# EAGLE schematic MbrdA_rev2.180 (EAGLE 7.2.0)
ENG_NAME: Sylwester Hyzynski

## Sheet 1 of 7
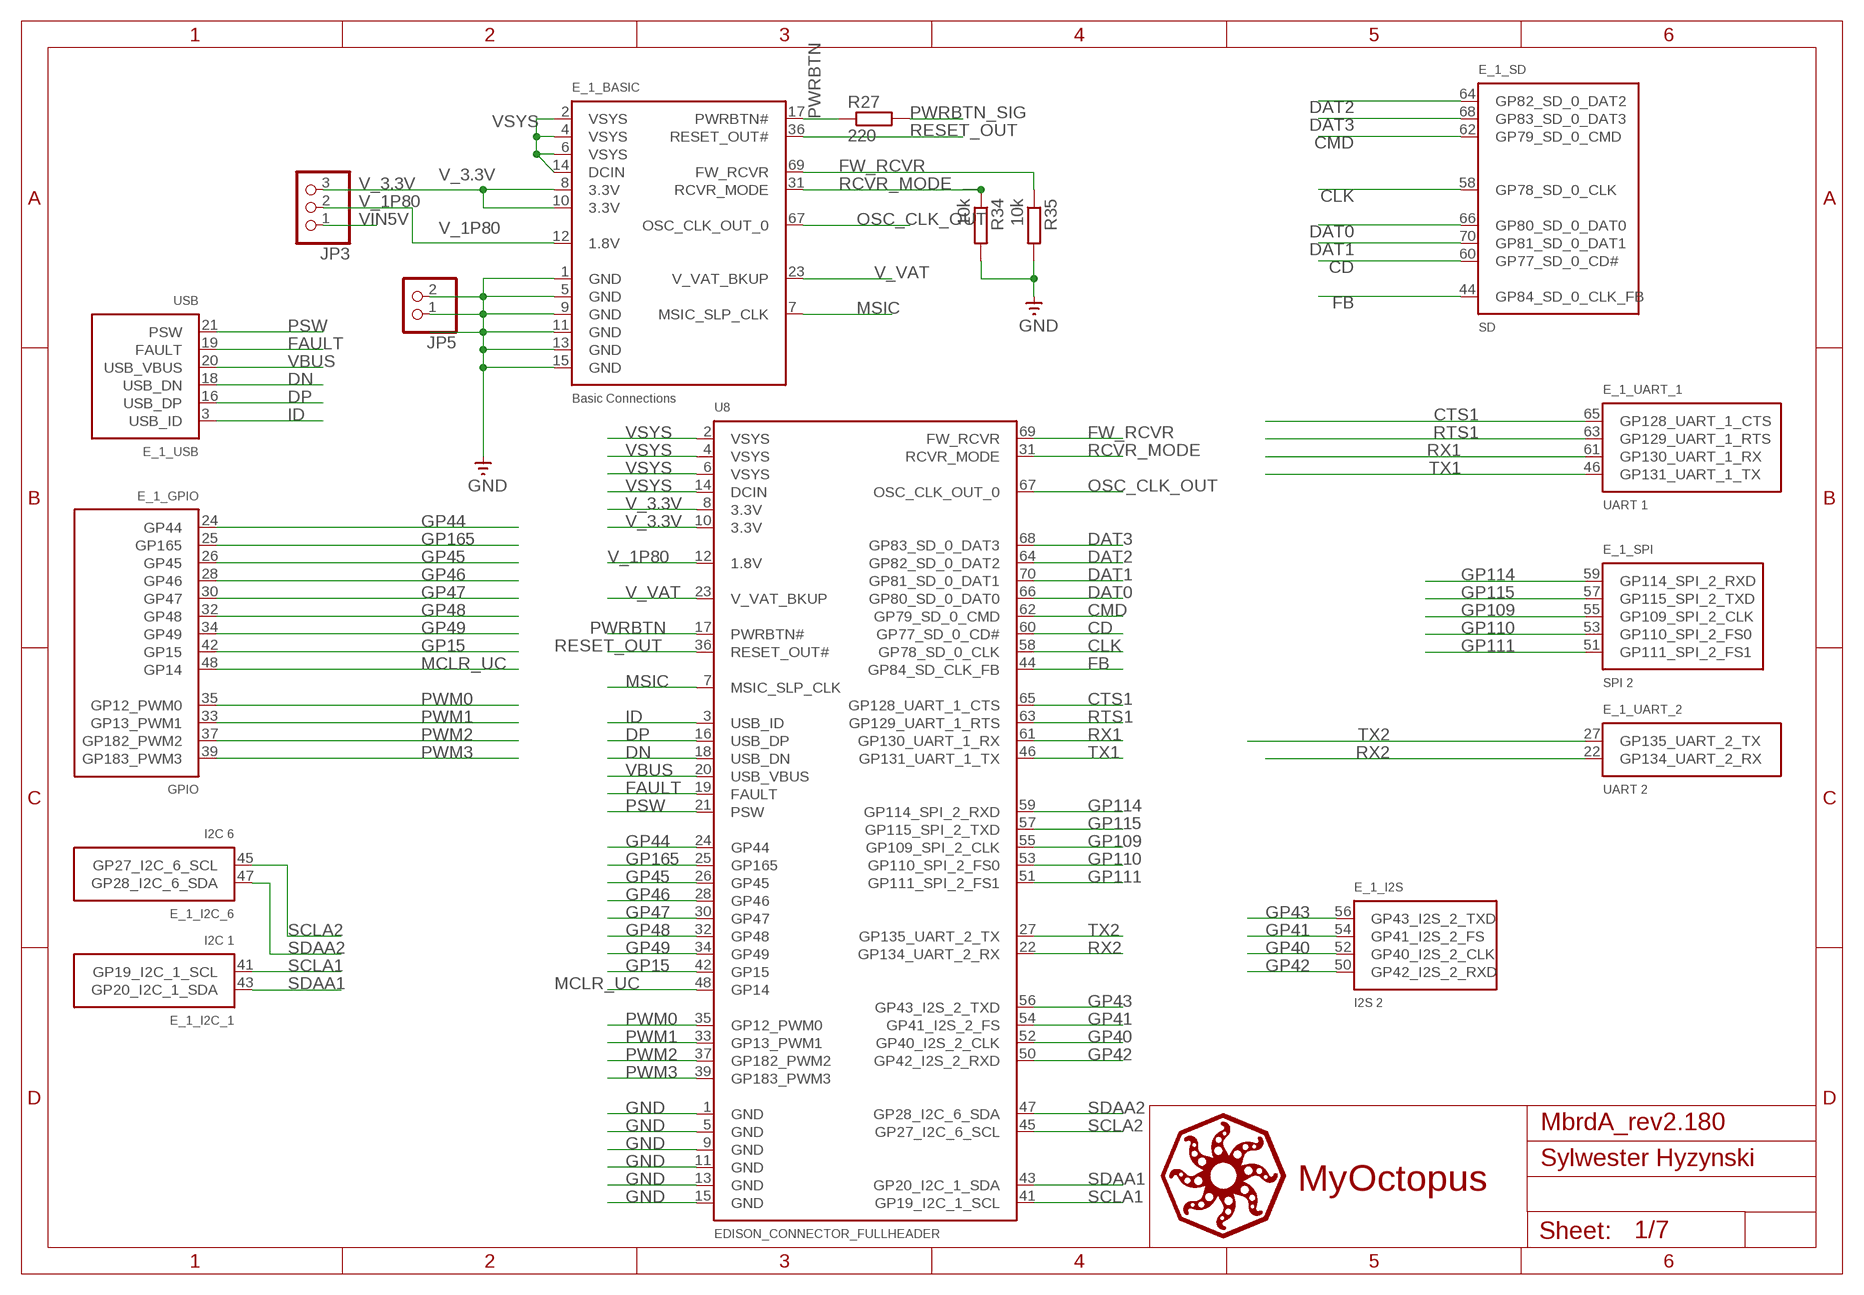
[diagram p0: schematic, sheet 1]

### Parts
E_1  EDISON_CONNECTOR_SEGMENTED  [EDISON_DAUGHTER]
JP3  PINHD-1X3  [1X03]
JP5  PINHD-1X2  [1X02]
R27  220  R-EU_R0201  [R0201]
R34  10k  R-EU_R0201  [R0201]
R35  10k  R-EU_R0201  [R0201]
U8  EDISON_CONNECTOR_FULLHEADER  [DF40C-70DP-0.4(51)]

### Nets
CD: E_1.60(_SD:GP77_SD_0_CD#) U8.60(GP77_SD_0_CD#) ; also sheet 6
CLK: E_1.58(_SD:GP78_SD_0_CLK) U8.58(GP78_SD_0_CLK) ; also sheet 6
CMD: E_1.62(_SD:GP79_SD_0_CMD) U8.62(GP79_SD_0_CMD) ; also sheet 6
CTS1: E_1.65(_UART_1:GP128_UART_1_CTS) U8.65(GP128_UART_1_CTS) ; also sheet 6
DAT0: E_1.66(_SD:GP80_SD_0_DAT0) U8.66(GP80_SD_0_DAT0) ; also sheet 6
DAT1: E_1.70(_SD:GP81_SD_0_DAT1) U8.70(GP81_SD_0_DAT1) ; also sheet 6
DAT2: E_1.64(_SD:GP82_SD_0_DAT2) U8.64(GP82_SD_0_DAT2) ; also sheet 6
DAT3: E_1.68(_SD:GP83_SD_0_DAT3) U8.68(GP83_SD_0_DAT3) ; also sheet 6
DN: E_1.18(_USB:USB_DN) U8.18(USB_DN) ; also sheet 5
DP: E_1.16(_USB:USB_DP) U8.16(USB_DP) ; also sheet 5
FAULT: E_1.19(_USB:FAULT) U8.19(FAULT) ; also sheet 5
FB: E_1.44(_SD:GP84_SD_0_CLK_FB) U8.44(GP84_SD_CLK_FB) ; also sheet 6
FW_RCVR: E_1.69(_BASIC:FW_RCVR) R35.1 U8.69(FW_RCVR) ; also sheet 6
GND: E_1.1(_BASIC:GND) E_1.5(_BASIC:GND) E_1.9(_BASIC:GND) E_1.11(_BASIC:GND) E_1.13(_BASIC:GND) E_1.15(_BASIC:GND) JP5.1 JP5.2 R34.2 R35.2 U8.1(GND) U8.5(GND) U8.9(GND) U8.11(GND) U8.13(GND) U8.15(GND) ; also sheet 2,3,4,5,6,7
GP15: E_1.42(_GPIO:GP15) U8.42(GP15)
GP40: E_1.52(_I2S:GP40_I2S_2_CLK) U8.52(GP40_I2S_2_CLK)
GP41: E_1.54(_I2S:GP41_I2S_2_FS) U8.54(GP41_I2S_2_FS)
GP42: E_1.50(_I2S:GP42_I2S_2_RXD) U8.50(GP42_I2S_2_RXD)
GP43: E_1.56(_I2S:GP43_I2S_2_TXD) U8.56(GP43_I2S_2_TXD)
GP44: E_1.24(_GPIO:GP44) U8.24(GP44) ; also sheet 6
GP45: E_1.26(_GPIO:GP45) U8.26(GP45) ; also sheet 6
GP46: E_1.28(_GPIO:GP46) U8.28(GP46) ; also sheet 6
GP47: E_1.30(_GPIO:GP47) U8.30(GP47)
GP48: E_1.32(_GPIO:GP48) U8.32(GP48) ; also sheet 6
GP49: E_1.34(_GPIO:GP49) U8.34(GP49) ; also sheet 6
GP109: E_1.55(_SPI:GP109_SPI_2_CLK) U8.55(GP109_SPI_2_CLK)
GP110: E_1.53(_SPI:GP110_SPI_2_FS0) U8.53(GP110_SPI_2_FS0)
GP111: E_1.51(_SPI:GP111_SPI_2_FS1) U8.51(GP111_SPI_2_FS1)
GP114: E_1.59(_SPI:GP114_SPI_2_RXD) U8.59(GP114_SPI_2_RXD)
GP115: E_1.57(_SPI:GP115_SPI_2_TXD) U8.57(GP115_SPI_2_TXD)
GP165: E_1.25(_GPIO:GP165) U8.25(GP165) ; also sheet 6
ID: E_1.3(_USB:USB_ID) U8.3(USB_ID) ; also sheet 5
MCLR_UC: E_1.48(_GPIO:GP14) U8.48(GP14) ; also sheet 4
MSIC: E_1.7(_BASIC:MSIC_SLP_CLK) U8.7(MSIC_SLP_CLK)
OSC_CLK_OUT: E_1.67(_BASIC:OSC_CLK_OUT_0) U8.67(OSC_CLK_OUT_0)
PSW: E_1.21(_USB:PSW) U8.21(PSW) ; also sheet 5
PWM0: E_1.35(_GPIO:GP12_PWM0) U8.35(GP12_PWM0) ; also sheet 6
PWM1: E_1.33(_GPIO:GP13_PWM1) U8.33(GP13_PWM1) ; also sheet 6
PWM2: E_1.37(_GPIO:GP182_PWM2) U8.37(GP182_PWM2)
PWM3: E_1.39(_GPIO:GP183_PWM3) U8.39(GP183_PWM3)
PWRBTN: E_1.17(_BASIC:PWRBTN#) R27.1 U8.17(PWRBTN#)
PWRBTN_SIG: R27.2 ; also sheet 4
RCVR_MODE: E_1.31(_BASIC:RCVR_MODE) R34.1 U8.31(RCVR_MODE) ; also sheet 6
RESET_OUT: E_1.36(_BASIC:RESET_OUT#) U8.36(RESET_OUT#) ; also sheet 4
RTS1: E_1.63(_UART_1:GP129_UART_1_RTS) U8.63(GP129_UART_1_RTS) ; also sheet 6
RX1: E_1.61(_UART_1:GP130_UART_1_RX) U8.61(GP130_UART_1_RX) ; also sheet 6
RX2: E_1.22(_UART_2:GP134_UART_2_RX) U8.22(GP134_UART_2_RX) ; also sheet 6
SCLA1: E_1.41(_I2C_1:GP19_I2C_1_SCL) U8.41(GP19_I2C_1_SCL) ; also sheet 2
SCLA2: E_1.45(_I2C_6:GP27_I2C_6_SCL) U8.45(GP27_I2C_6_SCL) ; also sheet 2
SDAA1: E_1.43(_I2C_1:GP20_I2C_1_SDA) U8.43(GP20_I2C_1_SDA) ; also sheet 2
SDAA2: E_1.47(_I2C_6:GP28_I2C_6_SDA) U8.47(GP28_I2C_6_SDA) ; also sheet 2
TX1: E_1.46(_UART_1:GP131_UART_1_TX) U8.46(GP131_UART_1_TX) ; also sheet 6
TX2: E_1.27(_UART_2:GP135_UART_2_TX) U8.27(GP135_UART_2_TX) ; also sheet 6
V_1P80 [v_1P80]: E_1.12(_BASIC:1.8V) JP3.2 U8.12(1.8V) ; also sheet 2,4,5,6
V_3.3V [v_3.3V]: E_1.8(_BASIC:3.3V) E_1.10(_BASIC:3.3V) JP3.3 U8.8(3.3V) U8.10(3.3V) ; also sheet 2,6,7
V_VAT: E_1.23(_BASIC:V_VAT_BKUP) U8.23(V_VAT_BKUP)
VBUS: E_1.20(_USB:USB_VBUS) U8.20(USB_VBUS) ; also sheet 5
VIN5V [Vin5v]: JP3.1 ; also sheet 2,3,4,5,6,7
VSYS: E_1.2(_BASIC:VSYS) E_1.4(_BASIC:VSYS) E_1.6(_BASIC:VSYS) E_1.14(_BASIC:DCIN) U8.2(VSYS) U8.4(VSYS) U8.6(VSYS) U8.14(DCIN) ; also sheet 4,5

## Sheet 2 of 7
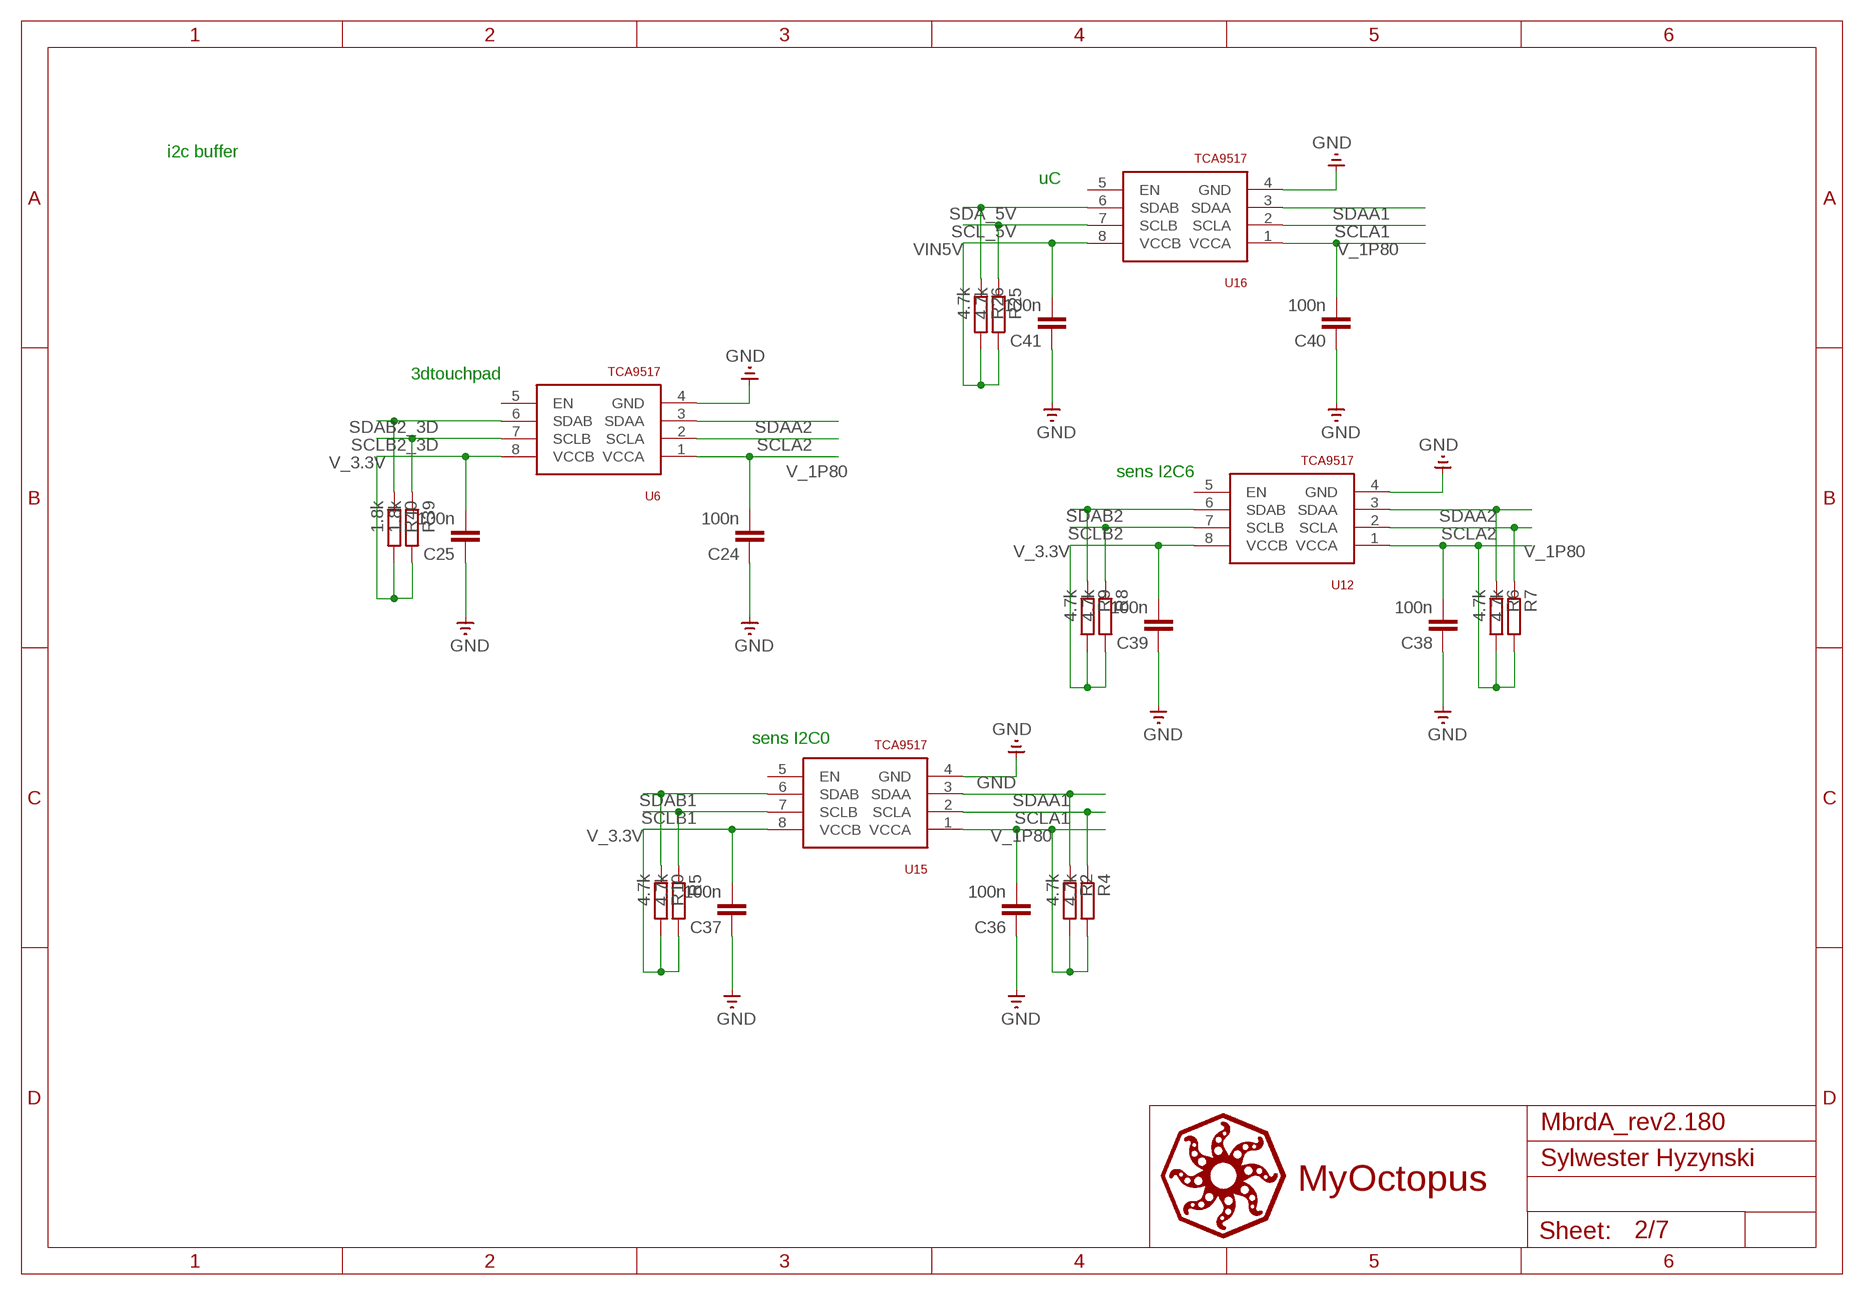
[diagram p1: schematic, sheet 2]

### Parts
C24  100n  C-EUC0201  [C0201]
C25  100n  C-EUC0201  [C0201]
C36  100n  C-EUC0201  [C0201]
C37  100n  C-EUC0201  [C0201]
C38  100n  C-EUC0201  [C0201]
C39  100n  C-EUC0201  [C0201]
C40  100n  C-EUC0201  [C0201]
C41  100n  C-EUC0201  [C0201]
R2  4.7k  R-EU_R0201  [R0201]
R4  4.7k  R-EU_R0201  [R0201]
R5  4.7k  R-EU_R0201  [R0201]
R6  4.7k  R-EU_R0201  [R0201]
R7  4.7k  R-EU_R0201  [R0201]
R8  4.7k  R-EU_R0201  [R0201]
R9  4.7k  R-EU_R0201  [R0201]
R10  4.7k  R-EU_R0201  [R0201]
R25  4.7k  R-EU_R0201  [R0201]
R26  4.7k  R-EU_R0201  [R0201]
R39  1.8k  R-EU_R0201  [R0201]
R40  1.8k  R-EU_R0201  [R0201]
U6  TCA9517  [SO-08]
U12  TCA9517  [SO-08]
U15  TCA9517  [SO-08]
U16  TCA9517  [SO-08]

### Nets
GND: C24.1 C25.1 C36.1 C37.1 C38.1 C39.1 C40.1 C41.1 U6.4(GND) U12.4(GND) U15.4(GND) U16.4(GND) ; also sheet 1,3,4,5,6,7
SCL_5V: R25.1 U16.7(SCLB) ; also sheet 3
SCLA1: R4.1 U15.2(SCLA) U16.2(SCLA) ; also sheet 1
SCLA2: R7.1 U6.2(SCLA) U12.2(SCLA) ; also sheet 1
SCLB1: R5.1 U15.7(SCLB) ; also sheet 7
SCLB2: R8.1 U12.7(SCLB) ; also sheet 7
SCLB2_3D: R39.1 U6.7(SCLB) ; also sheet 7
SDA_5V: R26.1 U16.6(SDAB) ; also sheet 3
SDAA1: R2.1 U15.3(SDAA) U16.3(SDAA) ; also sheet 1
SDAA2: R6.1 U6.3(SDAA) U12.3(SDAA) ; also sheet 1
SDAB1: R10.1 U15.6(SDAB) ; also sheet 7
SDAB2: R9.1 U12.6(SDAB) ; also sheet 7
SDAB2_3D: R40.1 U6.6(SDAB) ; also sheet 7
V_1P80 [v_1P80]: C24.2 C36.2 C38.2 C40.2 R2.2 R4.2 R6.2 R7.2 U6.1(VCCA) U12.1(VCCA) U15.1(VCCA) U16.1(VCCA) ; also sheet 1,4,5,6
V_3.3V [v_3.3V]: C25.2 C37.2 C39.2 R5.2 R8.2 R9.2 R10.2 R39.2 R40.2 U6.8(VCCB) U12.8(VCCB) U15.8(VCCB) ; also sheet 1,6,7
VIN5V [Vin5v]: C41.2 R25.2 R26.2 U16.8(VCCB) ; also sheet 1,3,4,5,6,7
Unconnected: U6.5(EN) U12.5(EN) U15.5(EN) U16.5(EN)

### Notes on the sheet
- i2c buffer
- uC
- 3dtouchpad
- sens I2C6
- sens I2C0

## Sheet 3 of 7
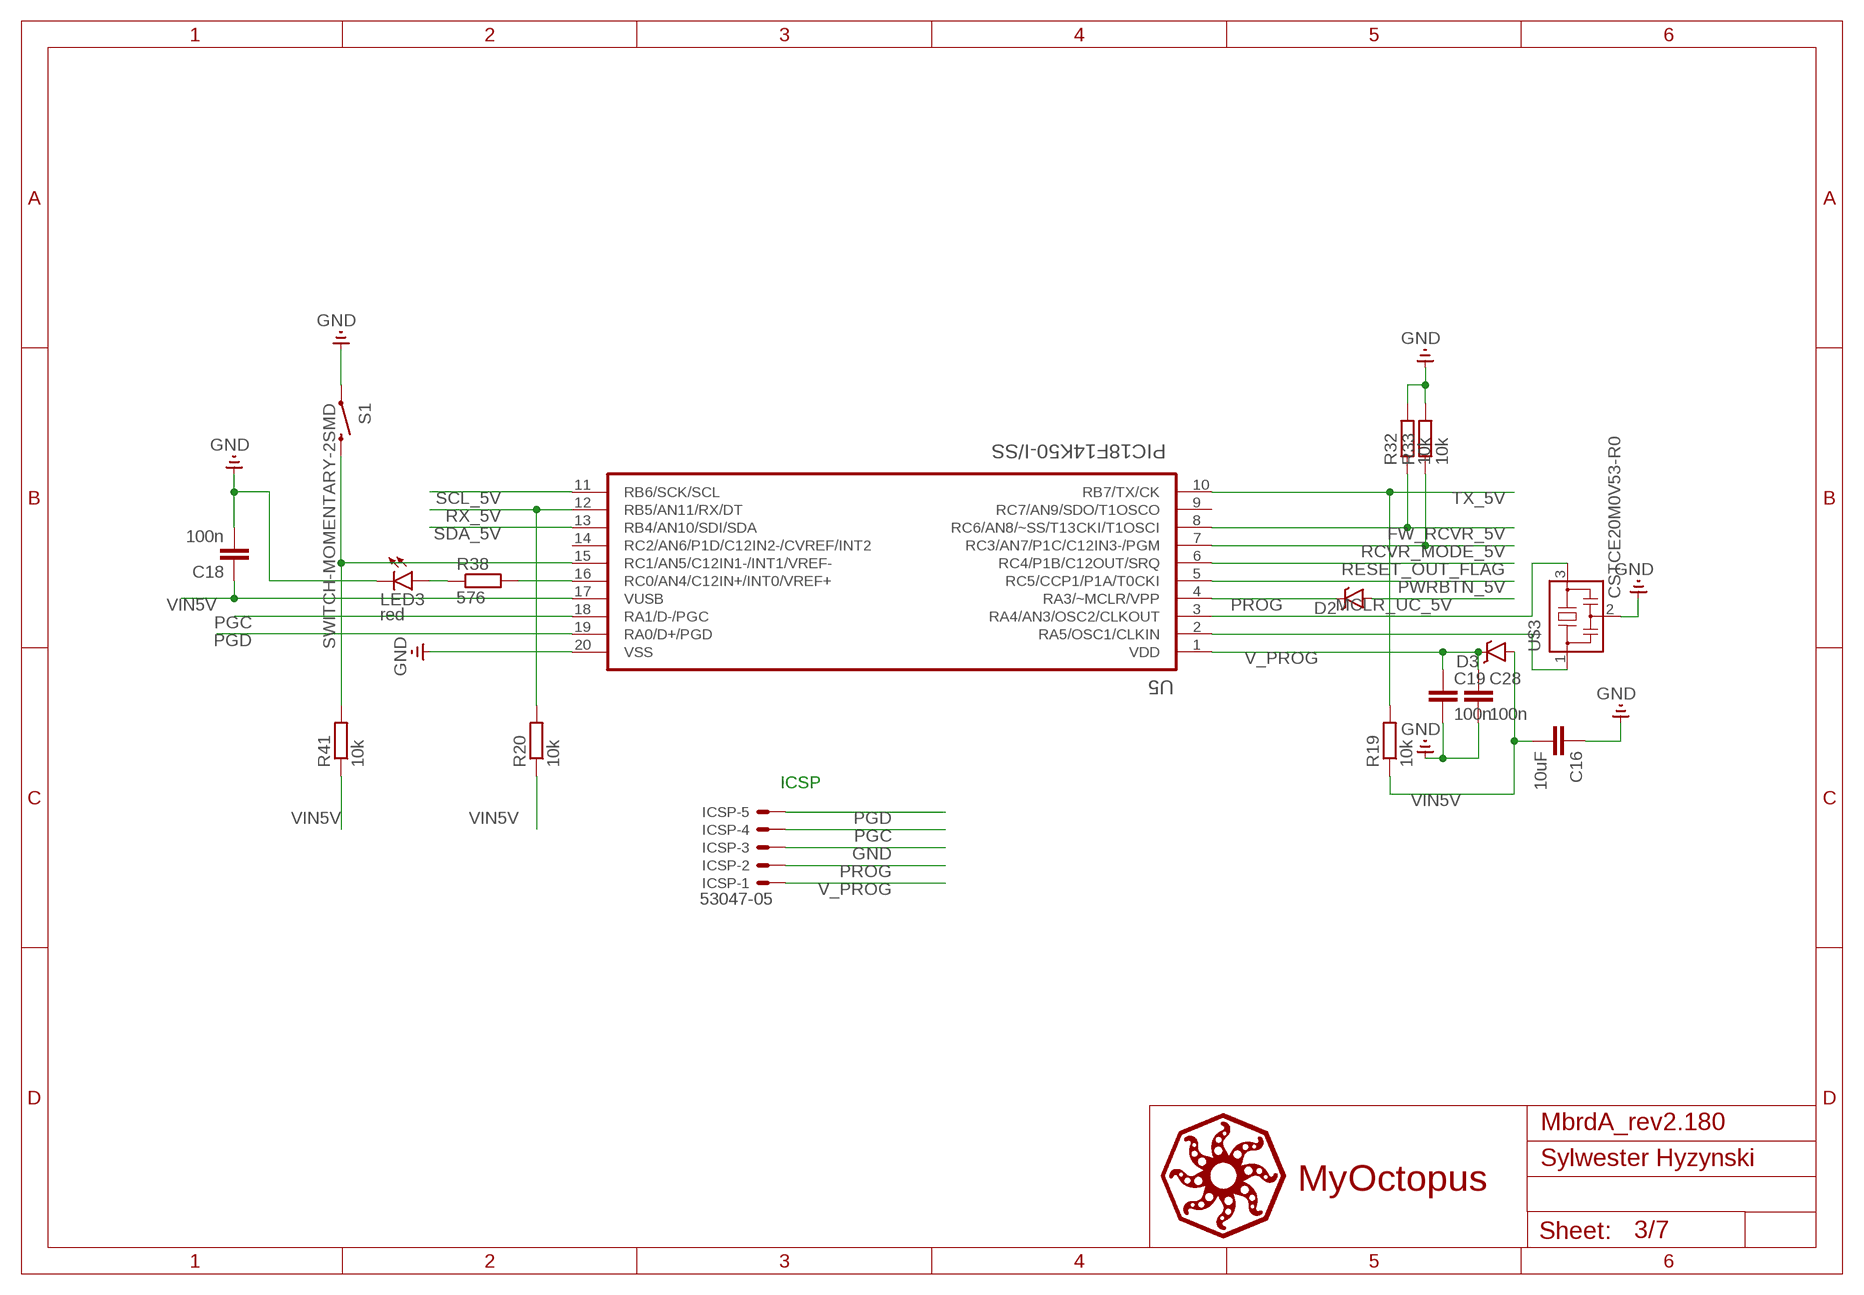
[diagram p2: schematic, sheet 3]

### Parts
C16  10uF  C-EUC0402  [C0402]
C18  100n  C-EUC0201  [C0201]
C19  100n  C-EUC0201  [C0201]
C28  100n  C-EUC0201  [C0201]
D2  DB2W31900L  [MINI-F3-B]
D3  DB2W31900L  [MINI-F3-B]
ICSP  53047-05  [53047-05]
LED3  red  LED0402  [LED0402]
R19  10k  R-EU_R0201  [R0201]
R20  10k  R-EU_R0201  [R0201]
R32  10k  R-EU_R0201  [R0201]
R33  10k  R-EU_R0201  [R0201]
R38  576  R-EU_R0201  [R0201]
R41  10k  R-EU_R0201  [R0201]
S1  SWITCH-MOMENTARY-2SMD  [TACTILE_SWITCH_SMD]
U5  PIC18F14K50-I/SS  [SOP65P780X200-20N]
U$3  CSTCE20M0V53-R0  [CSTER12M]

### Nets
FW_RCVR_5V: R32.1 U5.8(RC6/AN8/~SS/T13CKI/T1OSCI) ; also sheet 6
GND: C16.1 C18.2 C19.2 C28.2 ICSP.3 LED3.C R32.2 R33.2 S1.1 U5.20(VSS) U$3.2 ; also sheet 1,2,4,5,6,7
MCLR_UC_5V: D2.A ; also sheet 4
N$36: LED3.A R38.1
N$37: R38.2 U5.16(RC0/AN4/C12IN+/INT0/VREF+)
N$39: R41.2 S1.3 U5.15(RC1/AN5/C12IN1-/INT1/VREF-)
N$43: U5.2(RA5/OSC1/CLKIN) U$3.1
N$44: U5.3(RA4/AN3/OSC2/CLKOUT) U$3.3
PGC: ICSP.4 U5.18(RA1/D-/PGC)
PGD: ICSP.5 U5.19(RA0/D+/PGD)
PROG: D2.C ICSP.2 U5.4(RA3/~MCLR/VPP)
PWRBTN_5V: U5.5(RC5/CCP1/P1A/T0CKI) ; also sheet 4
RCVR_MODE_5V: R33.1 U5.7(RC3/AN7/P1C/C12IN3-/PGM) ; also sheet 6
RESET_OUT_FLAG: U5.6(RC4/P1B/C12OUT/SRQ) ; also sheet 4
RX_5V: R20.2 U5.12(RB5/AN11/RX/DT) ; also sheet 6
SCL_5V: U5.11(RB6/SCK/SCL) ; also sheet 2
SDA_5V: U5.13(RB4/AN10/SDI/SDA) ; also sheet 2
TX_5V: R19.2 U5.10(RB7/TX/CK) ; also sheet 6
V_PROG [Vin5v]: C19.1 C28.1 D3.C ICSP.1 U5.1(VDD)
VIN5V [Vin5v]: C16.2 C18.1 D3.A R19.1 R20.1 R41.1 U5.17(VUSB) ; also sheet 1,2,4,5,6,7
Unconnected: U5.9(RC7/AN9/SDO/T1OSCO) U5.14(RC2/AN6/P1D/C12IN2-/CVREF/INT2)

### Notes on the sheet
- ICSP

## Sheet 4 of 7
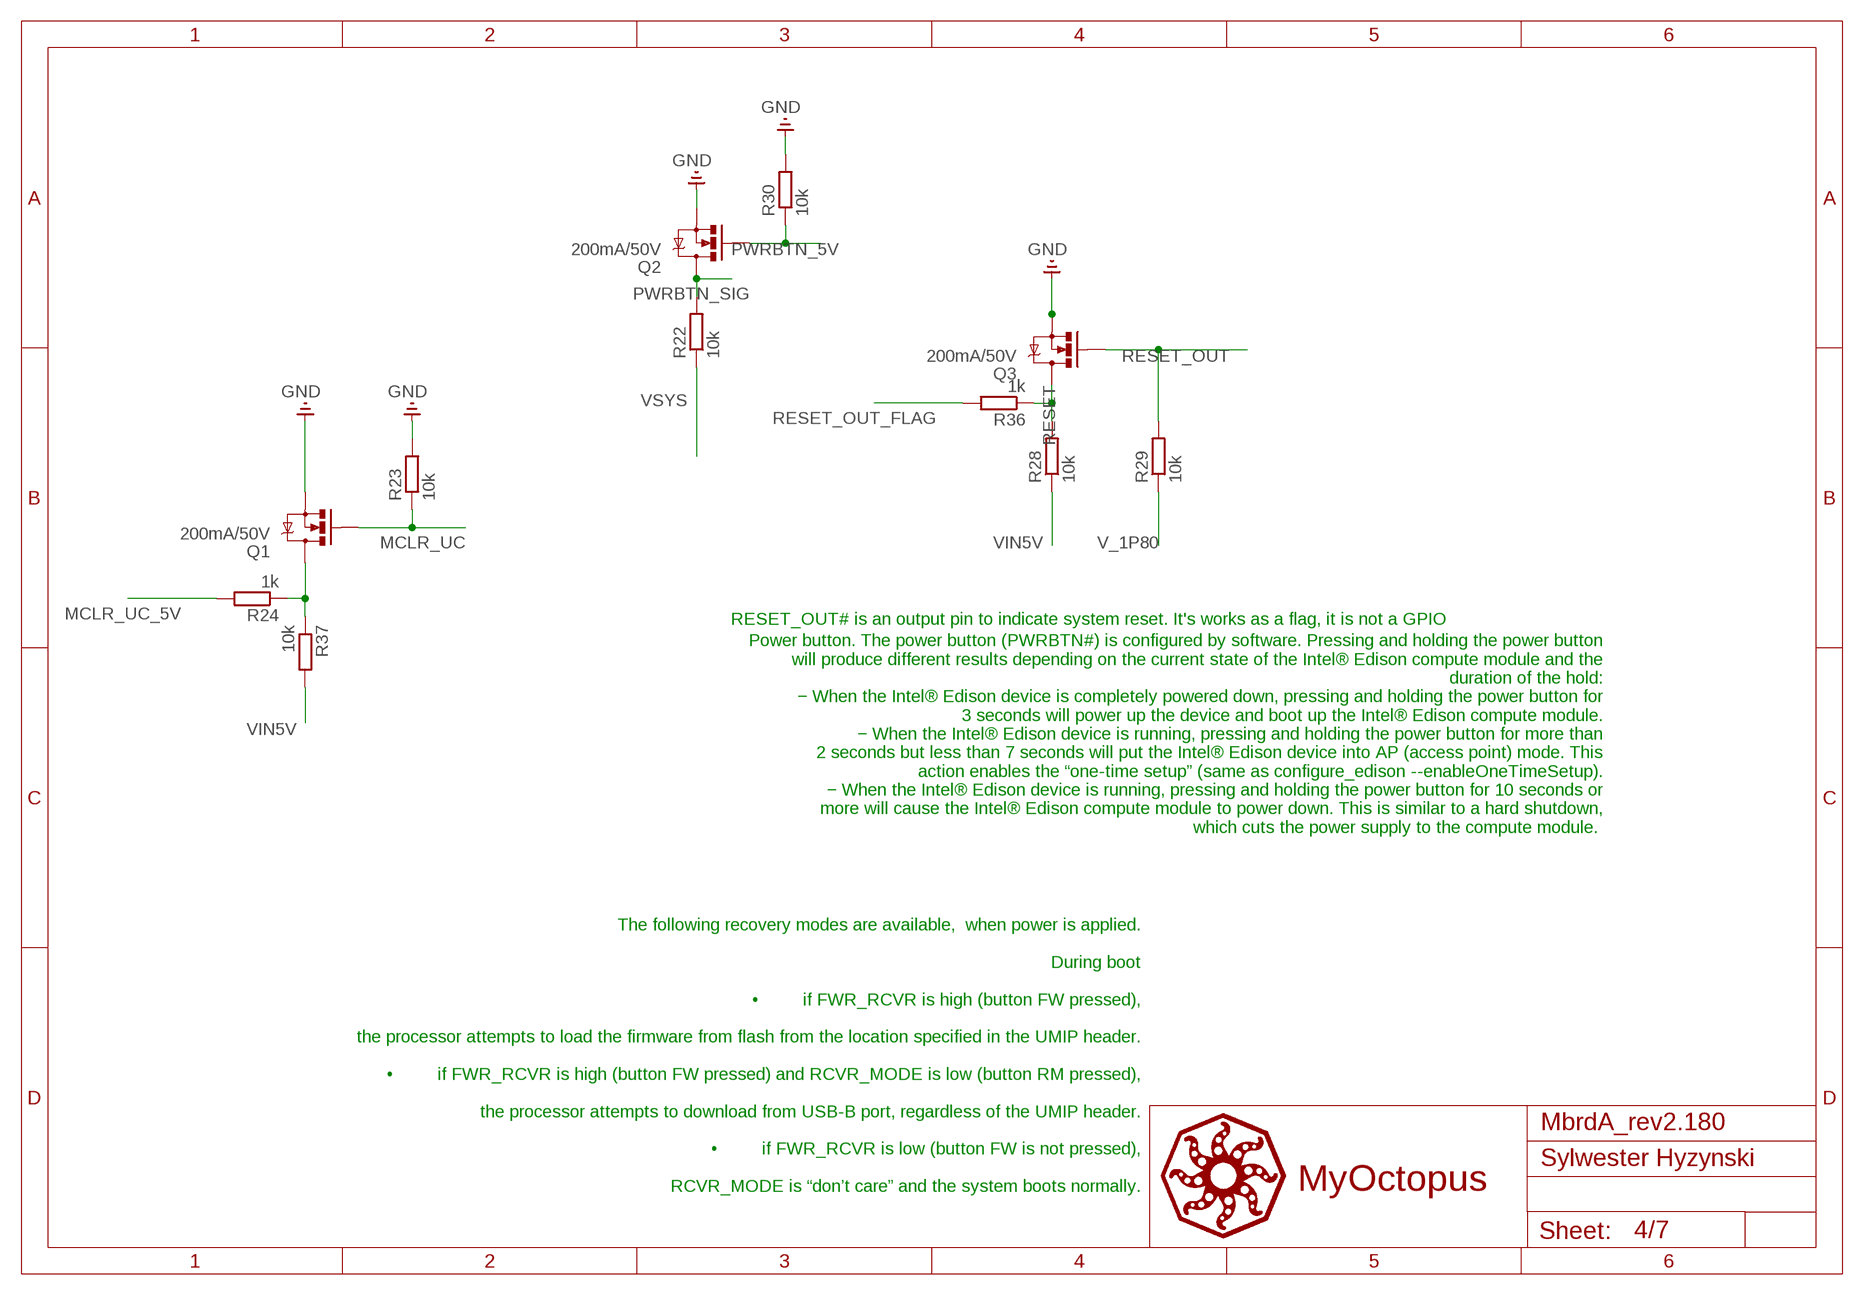
[diagram p3: schematic, sheet 4]

### Parts
Q1  200mA/50V  MOSFET-NCHANNELBSS138  [SOT23-3]
Q2  200mA/50V  MOSFET-NCHANNELBSS138  [SOT23-3]
Q3  200mA/50V  MOSFET-NCHANNELBSS138  [SOT23-3]
R22  10k  R-EU_R0201  [R0201]
R23  10k  R-EU_R0201  [R0201]
R24  1k  R-EU_R0201  [R0201]
R28  10k  R-EU_R0201  [R0201]
R29  10k  R-EU_R0201  [R0201]
R30  10k  R-EU_R0201  [R0201]
R36  1k  R-EU_R0201  [R0201]
R37  10k  R-EU_R0201  [R0201]

### Nets
GND: Q1.2(S) Q2.2(S) Q3.2(S) R23.2 R30.2 ; also sheet 1,2,3,5,6,7
MCLR_UC: Q1.1(G) R23.1 ; also sheet 1
MCLR_UC_5V: R24.2 ; also sheet 3
N$14: Q1.3(D) R24.1 R37.1
PWRBTN_5V: Q2.1(G) R30.1 ; also sheet 3
PWRBTN_SIG: Q2.3(D) R22.2 ; also sheet 1
RESET: Q3.3(D) R28.2 R36.1
RESET_OUT: Q3.1(G) R29.2 ; also sheet 1
RESET_OUT_FLAG: R36.2 ; also sheet 3
V_1P80 [v_1P80]: R29.1 ; also sheet 1,2,5,6
VIN5V [Vin5v]: R28.1 R37.2 ; also sheet 1,2,3,5,6,7
VSYS: R22.1 ; also sheet 1,5

### Notes on the sheet
- RESET_OUT# is an output pin to indicate system reset. It's works as a flag, it is not a GPIO
- Power button. The power button (PWRBTN#) is configured by software. Pressing and holding the power button
  will produce different results depending on the current state of the Intel® Edison compute module and the
  duration of the hold:
  − When the Intel® Edison device is completely powered down, pressing and holding the power button for
  3 seconds will power up the device and boot up the Intel® Edison compute module.
  − When the Intel® Edison device is running, pressing and holding the power button for more than
  2 seconds but less than 7 seconds will put the Intel® Edison device into AP (access point) mode. This
  action enables the “one-time setup” (same as configure_edison --enableOneTimeSetup).
  − When the Intel® Edison device is running, pressing and holding the power button for 10 seconds or
  more will cause the Intel® Edison compute module to power down. This is similar to a hard shutdown,
  which cuts the power supply to the compute module.
- The following recovery modes are available,  when power is applied.
  
  During boot
  
  •         if FWR_RCVR is high (button FW pressed),
  
  the processor attempts to load the firmware from flash from the location specified in the UMIP header.
  
  •         if FWR_RCVR is high (button FW pressed) and RCVR_MODE is low (button RM pressed),
  
  the processor attempts to download from USB-B port, regardless of the UMIP header.
  
  •         if FWR_RCVR is low (button FW is not pressed),
  
  RCVR_MODE is “don’t care” and the system boots normally.

## Sheet 5 of 7
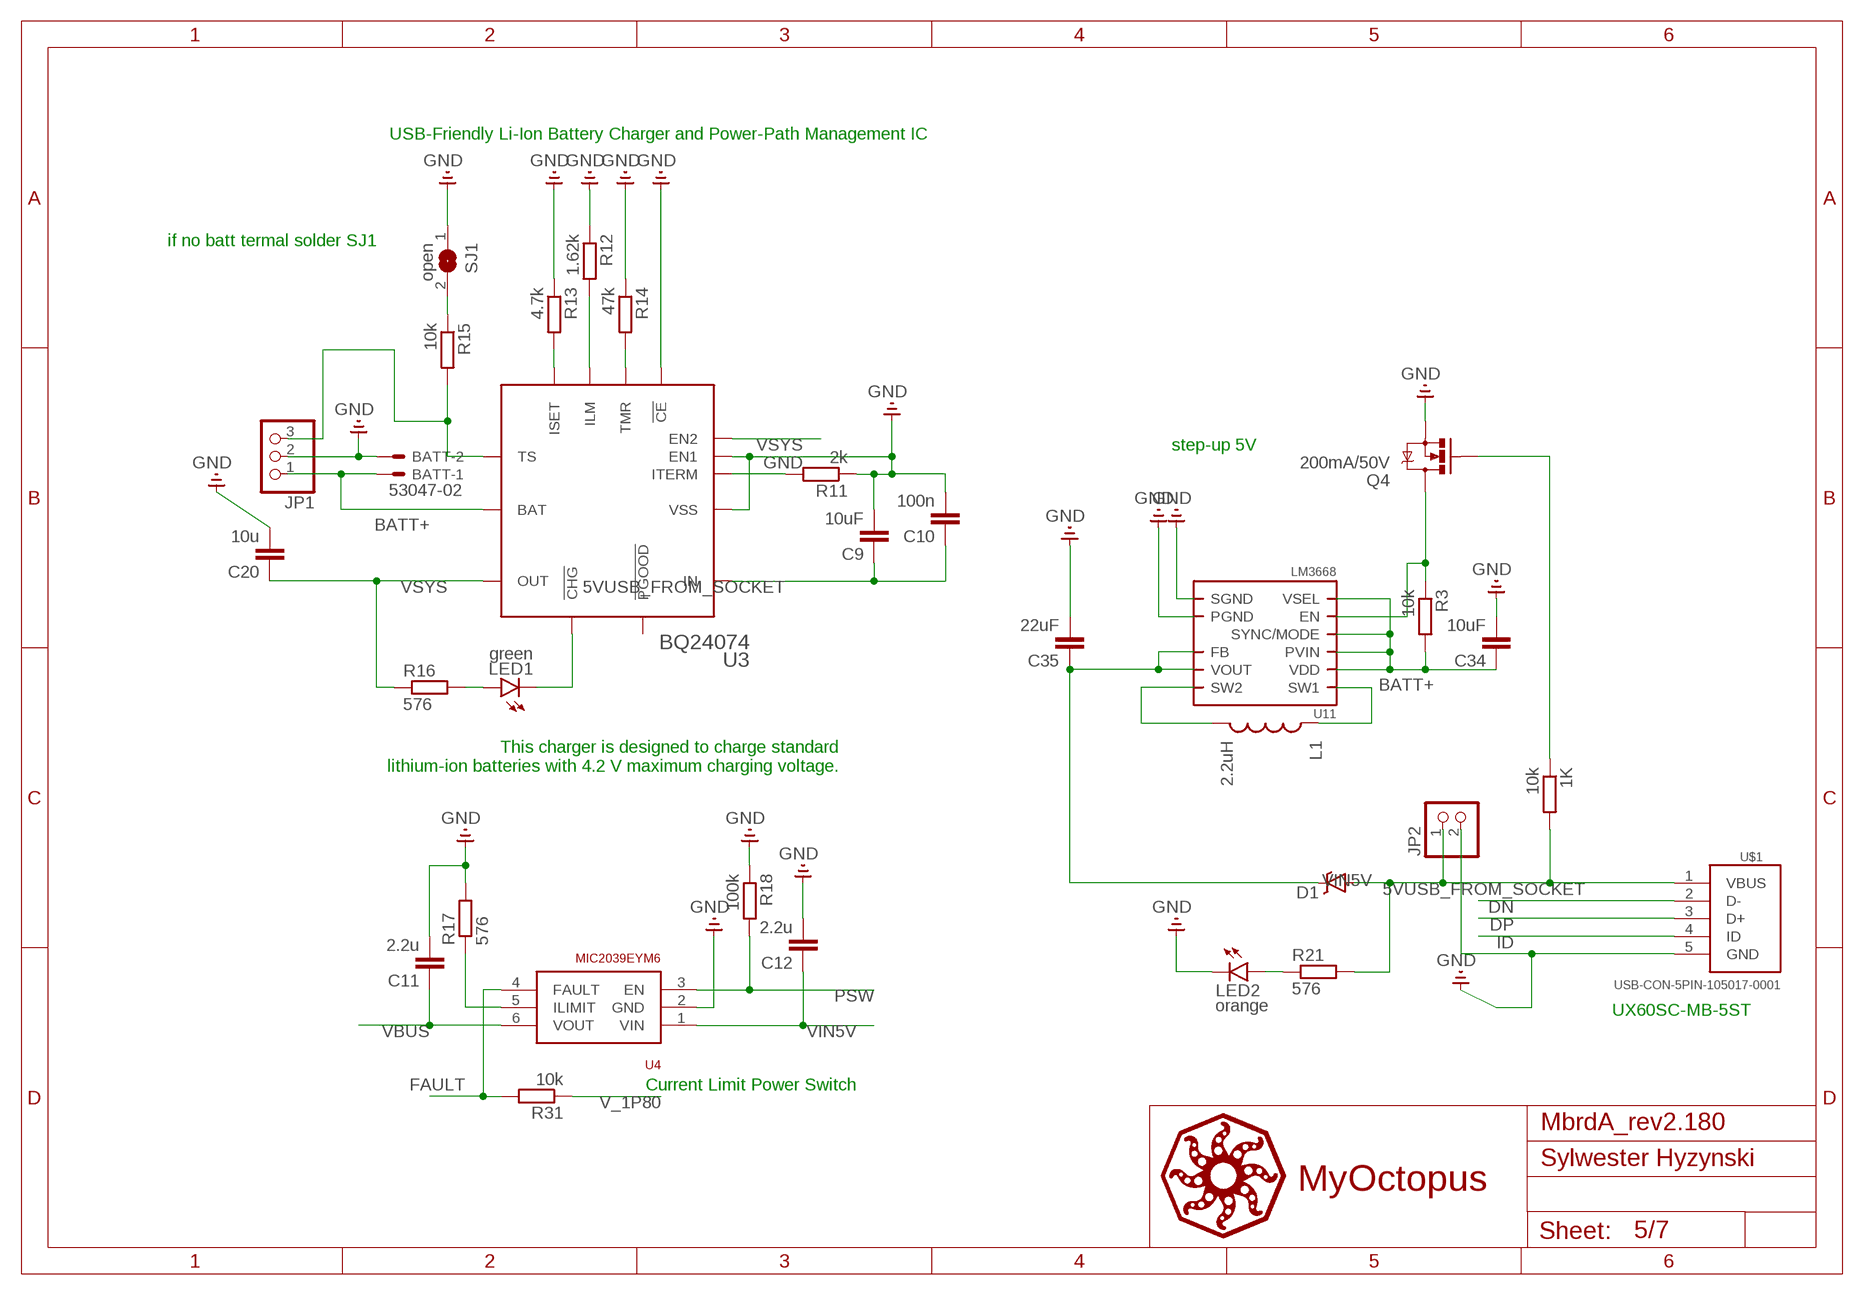
[diagram p4: schematic, sheet 5]

### Parts
1K  10k  R-EU_R0201  [R0201]
BATT  53047-02  [53047-02]
C9  10uF  C-EUC0402  [C0402]
C10  100n  C-EUC0201  [C0201]
C11  2.2u  C-EUC0603  [C0603]
C12  2.2u  C-EUC0603  [C0603]
C20  10u  C-EUC0402  [C0402]
C34  10uF  C-EUC0805  [C0805]
C35  22uF  C-EUC0805  [C0805]
D1  DB2W31900L  [MINI-F3-B]
JP1  PINHD-1X3  [1X03]
JP2  PINHD-1X2  [1X02]
L1  2.2uH  LPS4018  [LPS4018]
LED1  green  LED0402  [LED0402]
LED2  orange  LED0402  [LED0402]
Q4  200mA/50V  MOSFET-NCHANNELBSS138  [SOT23-3]
R3  10k  R-EU_R0201  [R0201]
R11  2k  R-EU_R0201  [R0201]
R12  1.62k  R-EU_R0201  [R0201]
R13  4.7k  R-EU_R0201  [R0201]
R14  47k  R-EU_R0201  [R0201]
R15  10k  R-EU_R0201  [R0201]
R16  576  R-EU_R0201  [R0201]
R17  576  R-EU_R0201  [R0201]
R18  100k  R-EU_R0201  [R0201]
R21  576  R-EU_R0201  [R0201]
R31  10k  R-EU_R0201  [R0201]
SJ1  open  SJ  [SJ]
U3  BQ24074  BQ2407XQFN-16  [QFN-16_BOT_PAD]
U4  MIC2039EYM6  [SOT23-6L]
U11  LM3668  [LLP.12.3X3MM]
U$1  USB-CON-5PIN-105017-0001  [USB-MICRO-MOLEX-105017-0001]

### Nets
5VUSB_FROM_SOCKET: 1K.2 C9.1 C10.1 D1.A JP2.1 R21.2 U3.13(IN) U$1.1(VBUS)
BATT+: BATT.1 C34.1 JP1.1 R3.2 U3.2(BAT) U3.3(BAT) U11.5(PVIN) U11.7(VDD) U11.10(SYNC/MODE) U11.11(VSEL)
DN: U$1.2(D-) ; also sheet 1
DP: U$1.3(D+) ; also sheet 1
FAULT: R31.2 U4.4(FAULT) ; also sheet 1
GND: BATT.2 C9.2 C10.2 C11.2 C12.2 C20.2 C34.2 C35.2 JP1.2 JP2.2 LED2.C Q4.2(S) R11.1 R12.1 R13.1 R14.1 R17.2 R18.1 SJ1.1 U3.4(!CE) U3.6(EN1) U3.8(VSS) U3.PAD0(VSS) U3.PAD1(VSS) U4.2(GND) U11.3(PGND) U11.8(SGND) U11.9(SGND) U11.PAD(SGND) U$1.5(GND) ; also sheet 1,2,3,4,6,7
ID: U$1.4(ID) ; also sheet 1
N$1: R11.2 U3.15(ITERM)
N$2: LED1.C U3.9(!CHG)
N$3: R13.2 U3.16(ISET)
N$4: R12.2 U3.12(ILM)
N$5: R14.2 U3.14(TMR)
N$7: 1K.1 Q4.1(G)
N$8: LED1.A R16.2
N$9: JP1.3 R15.2 U3.1(TS)
N$10: R17.1 U4.5(ILIMIT)
N$11: Q4.3(D) R3.1 U11.6(EN)
N$13: L1.2 U11.2(SW2)
N$15: LED2.A R21.1
N$18: L1.1 U11.4(SW1)
N$28: R15.1 SJ1.2
PSW: R18.2 U4.3(EN) ; also sheet 1
V_1P80 [v_1P80]: R31.1 ; also sheet 1,2,4,6
VBUS: C11.1 U4.6(VOUT) ; also sheet 1
VIN5V [Vin5v]: C12.1 C35.1 D1.C U4.1(VIN) U11.1(VOUT) U11.12(FB) ; also sheet 1,2,3,4,6,7
VSYS: C20.1 R16.1 U3.5(EN2) U3.10(OUT) U3.11(OUT) ; also sheet 1,4
Unconnected: U3.7(!PGOOD)

### Notes on the sheet
- USB-Friendly Li-Ion Battery Charger and Power-Path Management IC
- if no batt termal solder SJ1
- step-up 5V
- This charger is designed to charge standard
  lithium-ion batteries with 4.2 V maximum charging voltage.
- UX60SC-MB-5ST
- Current Limit Power Switch

## Sheet 6 of 7
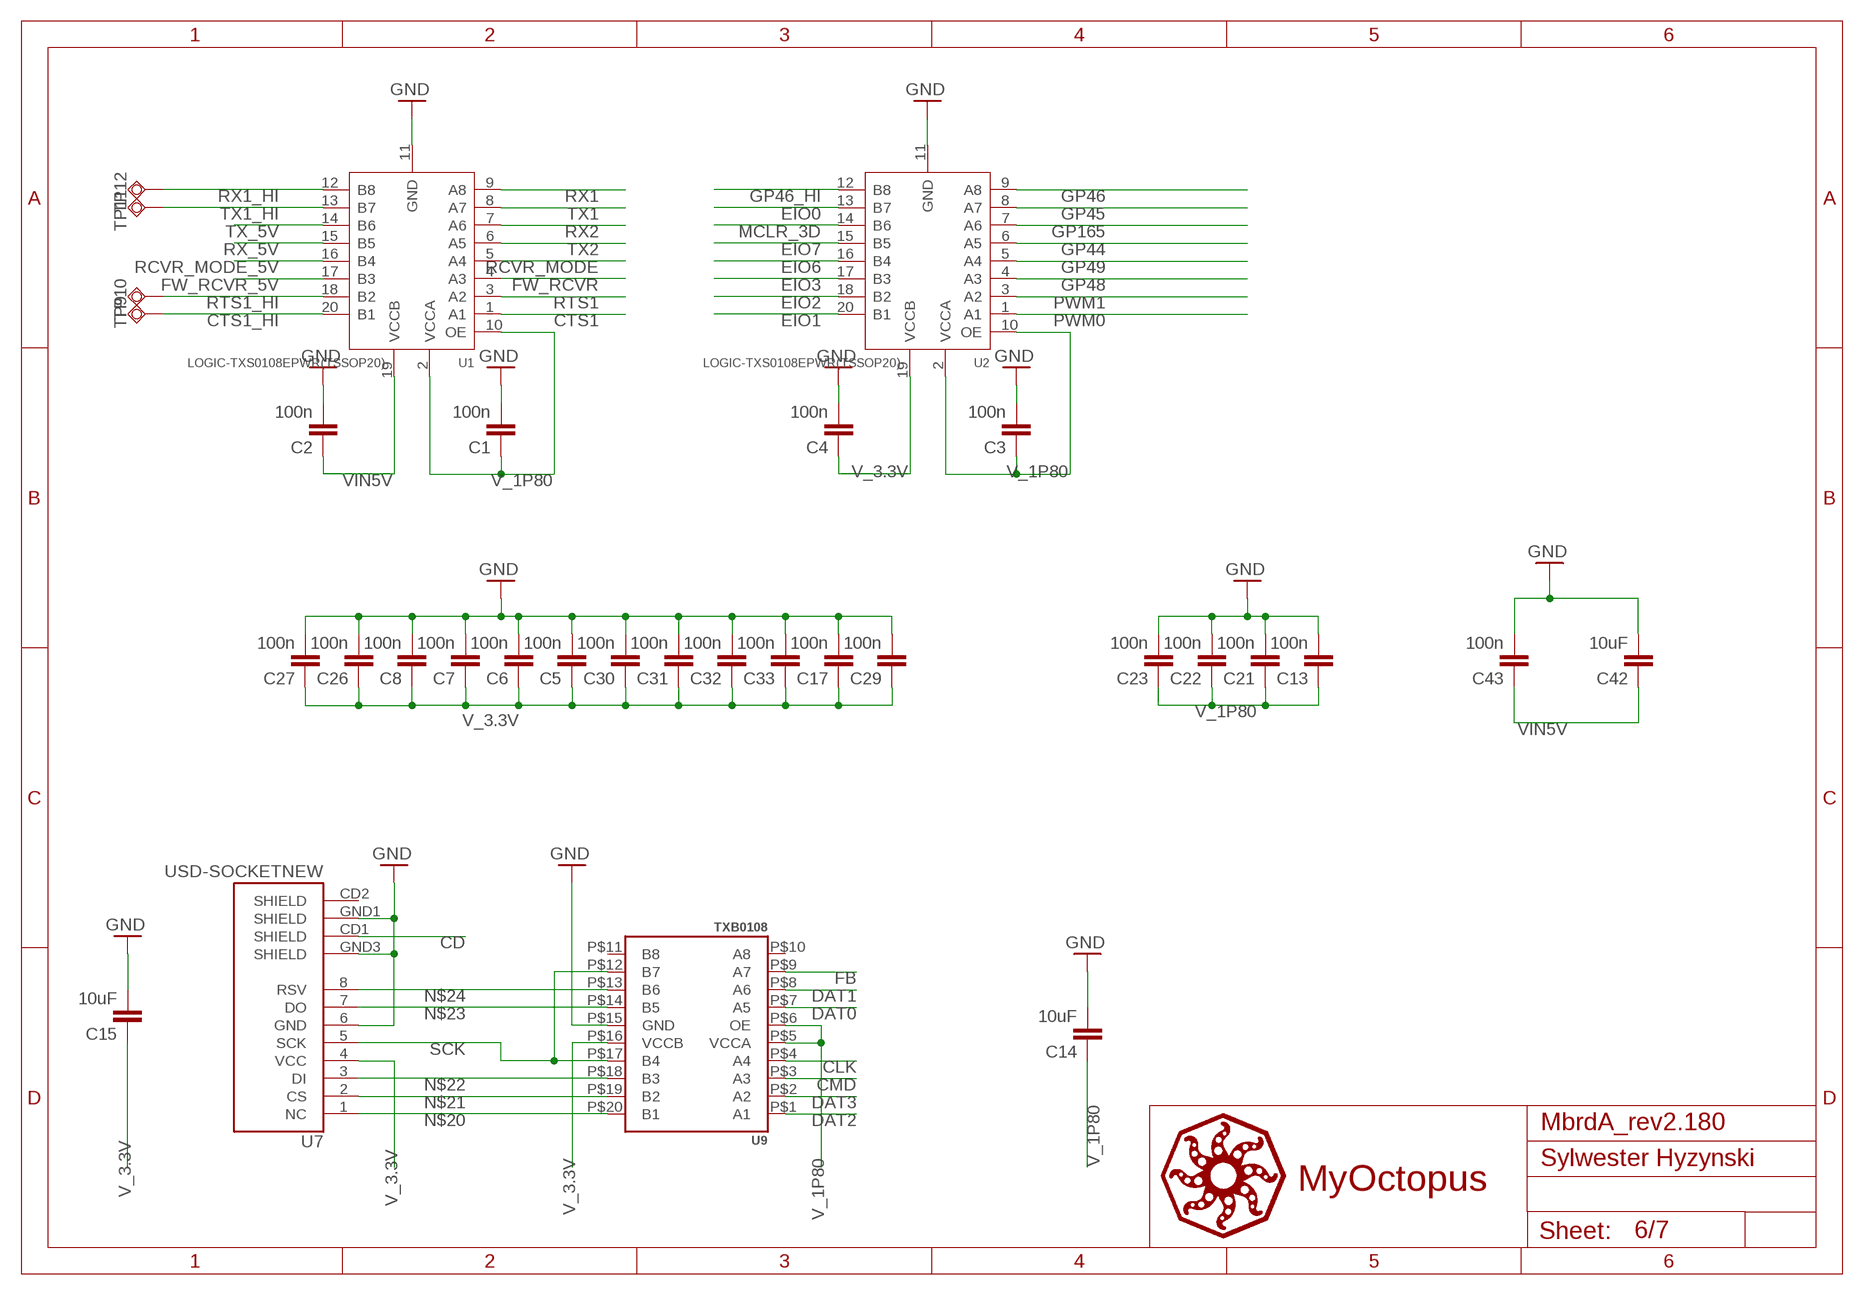
[diagram p5: schematic, sheet 6]

### Parts
C1  100n  C-EUC0201  [C0201]
C2  100n  C-EUC0201  [C0201]
C3  100n  C-EUC0201  [C0201]
C4  100n  C-EUC0201  [C0201]
C5  100n  C-EUC0201  [C0201]
C6  100n  C-EUC0201  [C0201]
C7  100n  C-EUC0201  [C0201]
C8  100n  C-EUC0201  [C0201]
C13  100n  C-EUC0201  [C0201]
C14  10uF  C-EUC0402  [C0402]
C15  10uF  C-EUC0402  [C0402]
C17  100n  C-EUC0201  [C0201]
C21  100n  C-EUC0201  [C0201]
C22  100n  C-EUC0201  [C0201]
C23  100n  C-EUC0201  [C0201]
C26  100n  C-EUC0201  [C0201]
C27  100n  C-EUC0201  [C0201]
C29  100n  C-EUC0201  [C0201]
C30  100n  C-EUC0201  [C0201]
C31  100n  C-EUC0201  [C0201]
C32  100n  C-EUC0201  [C0201]
C33  100n  C-EUC0201  [C0201]
C42  10uF  C-EUC0805  [C0805]
C43  100n  C-EUC0201  [C0201]
TP9  TPSQPAD1-13  [P1-13]
TP10  TPSQPAD1-13  [P1-13]
TP11  TPSQPAD1-13  [P1-13]
TP12  TPSQPAD1-13  [P1-13]
U1  LOGIC-TXS0108EPWR(TSSOP20)  [TSSOP20-0.65-6.5X4.4MM]
U2  LOGIC-TXS0108EPWR(TSSOP20)  [TSSOP20-0.65-6.5X4.4MM]
U7  USD-SOCKETNEW  [MICRO-SD-SOCKET-PP]
U9  TXB0108  [UFDFN-20]

### Nets
CD: U7.CD1(SHIELD) ; also sheet 1
CLK: U9.P$4(A4) ; also sheet 1
CMD: U9.P$3(A3) ; also sheet 1
CTS1: U1.1(A1) ; also sheet 1
CTS1_HI: TP9.TP U1.20(B1)
DAT0: U9.P$7(A5) ; also sheet 1
DAT1: U9.P$8(A6) ; also sheet 1
DAT2: U9.P$1(A1) ; also sheet 1
DAT3: U9.P$2(A2) ; also sheet 1
EIO0: U2.13(B7) ; also sheet 7
EIO1: U2.20(B1) ; also sheet 7
EIO2: U2.18(B2) ; also sheet 7
EIO3: U2.17(B3) ; also sheet 7
EIO6: U2.16(B4) ; also sheet 7
EIO7: U2.15(B5) ; also sheet 7
FB: U9.P$9(A7) ; also sheet 1
FW_RCVR: U1.4(A3) ; also sheet 1
FW_RCVR_5V: U1.17(B3) ; also sheet 3
GND: C1.2 C2.2 C3.2 C4.2 C5.2 C6.2 C7.2 C8.2 C13.2 C14.2 C15.2 C17.2 C21.2 C22.2 C23.2 C26.2 C27.2 C29.2 C30.2 C31.2 C32.2 C33.2 C42.2 C43.2 U1.11(GND) U2.11(GND) U7.6(GND) U7.GND1(SHIELD) U7.GND3(SHIELD) U9.P$15(GND) ; also sheet 1,2,3,4,5,7
GP44: U2.6(A5) ; also sheet 1
GP45: U2.8(A7) ; also sheet 1
GP46: U2.9(A8) ; also sheet 1
GP46_HI: U2.12(B8) ; also sheet 7
GP48: U2.4(A3) ; also sheet 1
GP49: U2.5(A4) ; also sheet 1
GP165: U2.7(A6) ; also sheet 1
MCLR_3D: U2.14(B6) ; also sheet 7
N$20: U7.1(NC) U9.P$20(B1)
N$21: U7.2(CS) U9.P$19(B2)
N$22: U7.3(DI) U9.P$18(B3)
N$23: U7.7(DO) U9.P$14(B5)
N$24: U7.8(RSV) U9.P$13(B6)
PWM0: U2.1(A1) ; also sheet 1
PWM1: U2.3(A2) ; also sheet 1
RCVR_MODE: U1.5(A4) ; also sheet 1
RCVR_MODE_5V: U1.16(B4) ; also sheet 3
RTS1: U1.3(A2) ; also sheet 1
RTS1_HI: TP10.TP U1.18(B2)
RX1: U1.9(A8) ; also sheet 1
RX1_HI: TP12.TP U1.12(B8)
RX2: U1.7(A6) ; also sheet 1
RX_5V: U1.15(B5) ; also sheet 3
SCK: U7.5(SCK) U9.P$12(B7) U9.P$17(B4)
TX1: U1.8(A7) ; also sheet 1
TX1_HI: TP11.TP U1.13(B7)
TX2: U1.6(A5) ; also sheet 1
TX_5V: U1.14(B6) ; also sheet 3
V_1P80 [v_1P80]: C1.1 C3.1 C13.1 C14.1 C21.1 C22.1 C23.1 U1.2(VCCA) U1.10(OE) U2.2(VCCA) U2.10(OE) U9.P$5(VCCA) U9.P$6(OE) ; also sheet 1,2,4,5
V_3.3V [v_3.3V]: C4.1 C5.1 C6.1 C7.1 C8.1 C15.1 C17.1 C26.1 C27.1 C29.1 C30.1 C31.1 C32.1 C33.1 U2.19(VCCB) U7.4(VCC) U9.P$16(VCCB) ; also sheet 1,2,7
VIN5V [Vin5v]: C2.1 C42.1 C43.1 U1.19(VCCB) ; also sheet 1,2,3,4,5,7
Unconnected: U7.CD2(SHIELD) U9.P$10(A8) U9.P$11(B8)

## Sheet 7 of 7
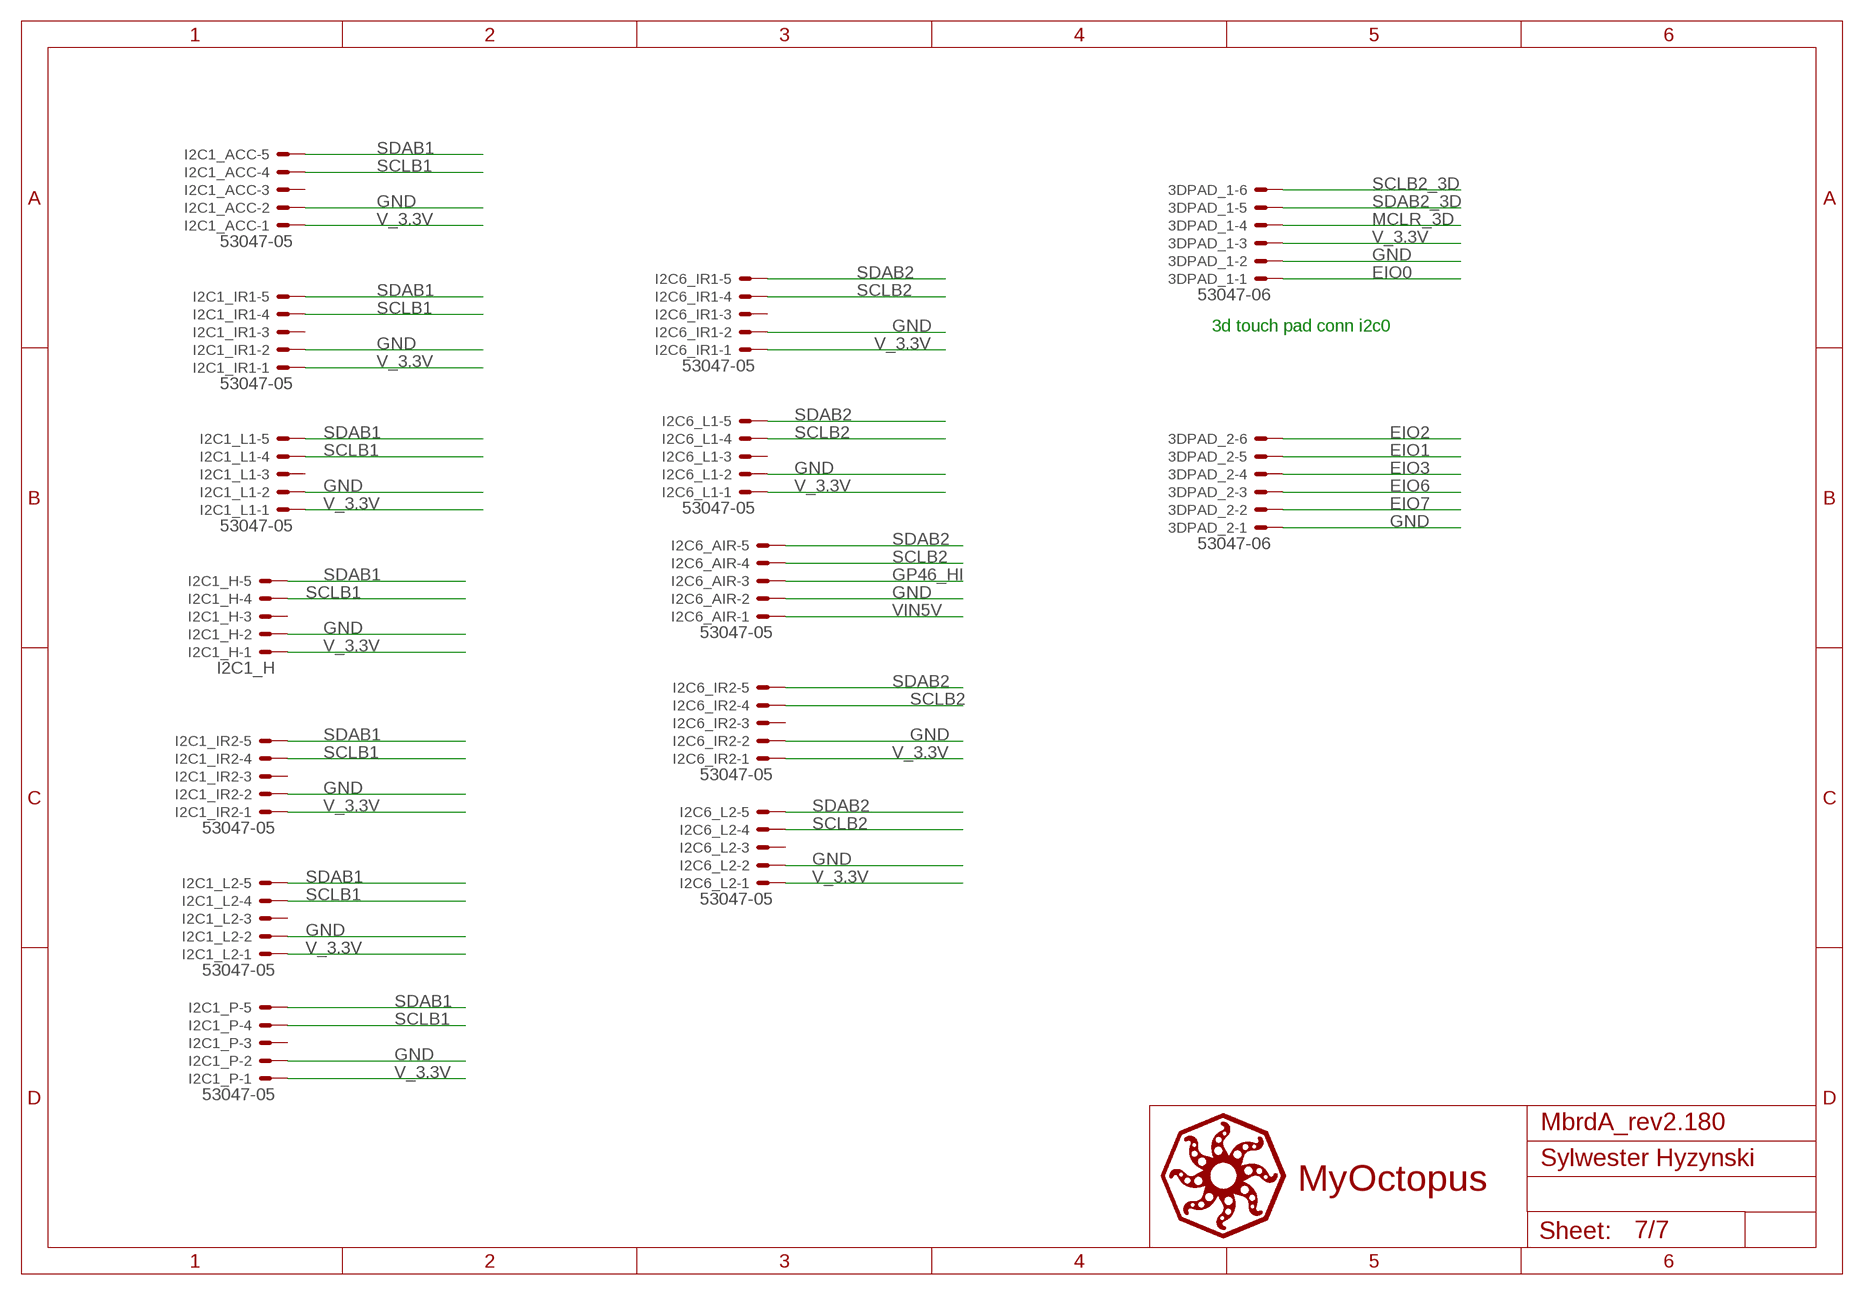
[diagram p6: schematic, sheet 7]

### Parts
3DPAD_1  53047-06  [53047-06]
3DPAD_2  53047-06  [53047-06]
I2C1_ACC  53047-05  [53047-05]
I2C1_H  I2C1_H  53047-05  [53047-05]
I2C1_IR1  53047-05  [53047-05]
I2C1_IR2  53047-05  [53047-05]
I2C1_L1  53047-05  [53047-05]
I2C1_L2  53047-05  [53047-05]
I2C1_P  53047-05  [53047-05]
I2C6_AIR  53047-05  [53047-05]
I2C6_IR1  53047-05  [53047-05]
I2C6_IR2  53047-05  [53047-05]
I2C6_L1  53047-05  [53047-05]
I2C6_L2  53047-05  [53047-05]

### Nets
EIO0: 3DPAD_1.1 ; also sheet 6
EIO1: 3DPAD_2.5 ; also sheet 6
EIO2: 3DPAD_2.6 ; also sheet 6
EIO3: 3DPAD_2.4 ; also sheet 6
EIO6: 3DPAD_2.3 ; also sheet 6
EIO7: 3DPAD_2.2 ; also sheet 6
GND: 3DPAD_1.2 3DPAD_2.1 I2C1_ACC.2 I2C1_H.2 I2C1_IR1.2 I2C1_IR2.2 I2C1_L1.2 I2C1_L2.2 I2C1_P.2 I2C6_AIR.2 I2C6_IR1.2 I2C6_IR2.2 I2C6_L1.2 I2C6_L2.2 ; also sheet 1,2,3,4,5,6
GP46_HI: I2C6_AIR.3 ; also sheet 6
MCLR_3D: 3DPAD_1.4 ; also sheet 6
SCLB1: I2C1_ACC.4 I2C1_H.4 I2C1_IR1.4 I2C1_IR2.4 I2C1_L1.4 I2C1_L2.4 I2C1_P.4 ; also sheet 2
SCLB2: I2C6_AIR.4 I2C6_IR1.4 I2C6_IR2.4 I2C6_L1.4 I2C6_L2.4 ; also sheet 2
SCLB2_3D: 3DPAD_1.6 ; also sheet 2
SDAB1: I2C1_ACC.5 I2C1_H.5 I2C1_IR1.5 I2C1_IR2.5 I2C1_L1.5 I2C1_L2.5 I2C1_P.5 ; also sheet 2
SDAB2: I2C6_AIR.5 I2C6_IR1.5 I2C6_IR2.5 I2C6_L1.5 I2C6_L2.5 ; also sheet 2
SDAB2_3D: 3DPAD_1.5 ; also sheet 2
V_3.3V [v_3.3V]: 3DPAD_1.3 I2C1_ACC.1 I2C1_H.1 I2C1_IR1.1 I2C1_IR2.1 I2C1_L1.1 I2C1_L2.1 I2C1_P.1 I2C6_IR1.1 I2C6_IR2.1 I2C6_L1.1 I2C6_L2.1 ; also sheet 1,2,6
VIN5V [Vin5v]: I2C6_AIR.1 ; also sheet 1,2,3,4,5,6
Unconnected: I2C1_ACC.3 I2C1_H.3 I2C1_IR1.3 I2C1_IR2.3 I2C1_L1.3 I2C1_L2.3 I2C1_P.3 I2C6_IR1.3 I2C6_IR2.3 I2C6_L1.3 I2C6_L2.3

### Notes on the sheet
- 3d touch pad conn i2c0

## Library data of the parts
1K R2-R10 R17 R19 R20 R22-R37 R39-R41 = rcl:R-EU_: RESISTOR, European symbol
3DPAD_1 3DPAD_2 = con-molex:53?-06: CONNECTOR wire to board 1.25 mm (.049 inch) pitch header; MPN: 53047-0610-C; OC_FARNELL: 9733078; OC_NEWARK: 03M2965
BATT = con-molex:53?-02: CONNECTOR wire to board 1.25 mm (.049 inch) pitch header; MF: MOLEX; MPN: 53047-0210; OC_FARNELL: 9733051; OC_NEWARK: 57H4701
C1-C8 C13 C17-C19 C21-C33 C36-C41 C43 = rcl:C-EU: CAPACITOR, European symbol
C9 C20 = rcl-2:C-EU: CAPACITOR, European symbol; MAN: CL05A106MQ5NUNC
C10 = rcl:C-EU: CAPACITOR, European symbol; MAN: GRM155R61C105KA12D
C11 C12 = rcl:C-EU: CAPACITOR, European symbol; MAN: C1608X5R1E225KT000E
C14-C16 = rcl-2:C-EU: CAPACITOR, European symbol
C34 C42 = rcl:C-EU: CAPACITOR, European symbol; MAN: GRM21BR60J106K Ceramic, X5R
C35 = rcl:C-EU: CAPACITOR, European symbol; MAN: JMK212BJ226MG Ceramic, X5R
D1-D3 = diode:DB2W31900L: DB2W31900L
E_1 = Edison:EDISON_CONNECTOR_SEGMENTED; MOUSER: 798-DF40HC3070DS4V51
I2C1_ACC I2C1_H I2C1_IR1 I2C1_IR2 I2C1_L1 I2C1_L2 I2C1_P I2C6_AIR I2C6_IR1 I2C6_IR2 I2C6_L1 I2C6_L2 ICSP = con-molex:53?-05: CONNECTOR wire to board 1.25 mm (.049 inch) pitch header; MF: MOLEX; MPN: 53047-0510; OC_FARNELL: 9732861; OC_NEWARK: 38C9901
JP1 JP3 = pinhead:PINHD-1X3: PIN HEADER
JP2 JP5 = pinhead:PINHD-1X2: PIN HEADER
L1 = LPS4018:LPS4018; MAN: LPS4018-222MLB
LED1 = myoctopus:LED0402: LED 0402; MAN: LNJ347W83RA
LED2 LED3 = myoctopus:LED0402: LED 0402
Q1-Q4 = SparkFun-DiscreteSemi:MOSFET-NCHANNEL: Common NMOSFET Parts MFG P/N Store ID Prod ID FDD8780 TRANS-09984 SI7820DN TRANS-11055 FDS6630A IC-08089 2N7002PW TRANS-11151 FQP30N06L COM-10213 TRANS-10060 BSS123LT1G TRANS-08345 BSS138 TRANS-00830 BS170 2N7000; PROD_ID: TRANS-00830
R11 = rcl:R-EU_: RESISTOR, European symbol; MAN: CRCW04022K00FKED
R12 = rcl:R-EU_: RESISTOR, European symbol; MAN: CRCW04021K62FKED
R13 = rcl:R-EU_: RESISTOR, European symbol; MAN: CRCW04024K70FKED
R14 = rcl:R-EU_: RESISTOR, European symbol; MAN: CRCW040247K0FKED
R15 = rcl:R-EU_: RESISTOR, European symbol; MAN: CRCW040210K0FKED
R16 R21 R38 = rcl:R-EU_: RESISTOR, European symbol; MAN: CRCW0402576RFKED
R18 = rcl:R-EU_: RESISTOR, European symbol; MAN: CRCW0402100KFKEDHP CRCW0402100KFKEDHP
S1 = SparkFun:SWITCH-MOMENTARY-2; MAN: KPT-1187B
SJ1 = jumper:SJ: SMD solder JUMPER
TP9-TP12 = testpad:TPSQ: Test pad
U1 U2 = LOGIC-TXS0108EPWR_TSSOP20_:LOGIC-TXS0108EPWR(TSSOP20): 310050026; MPN: TXS0108EPWR
U3 = PP_PowerIC:BQ2407X
U4 = mic2039:MIC2039EYM6: MIC2039EYM6
U5 = PIC18F14K50-I_SS:PIC18F14K50-I/SS: Flash Microcontrollers; MPN: PIC18F14K50-I/SS; OC_FARNELL: 1648504; OC_NEWARK: 77M3105; PACKAGE: SOP-20; SUPPLIER: Microchip
U6 U12 U15 U16 = TCA9517:TCA9517: TCA9517
U7 = SparkFun-Connectors:USD-SOCKET: microSD Socket Push-push type uSD socket. Schematic element and footprint production proven. Spark Fun Electronics SKU : PRT-00127. tDoc lines correctly indicate media card edge positions when inserting (unlocked, locked, depressed).; MAN: 4735-21001; MARK: farnell
U8 = Edison2:EDISON_CONNECTOR_FULL
U9 = Testing:TXB0108
U11 = packages(ti):LM3668
U$1 = GeekAmmo:USB-CON-5PIN: Molex Micro USB 105017-0001
U$3 = cstce-resonator:CSTCE20M0V53-R0; MAN: CSTCE20M0V53-R0

## Net classes
1 Vin5v: width 0.381 mm
2 vsys: width 0.254 mm
3 v_3.3V: width 0.254 mm
4 v_1P80: width 0.254 mm
5 screw: width 1.27 mm, drill 1.27 mm, clearance 0.254 mm